# EasyEDA Pro project 主板&9V稳压.epro, board 主板V1
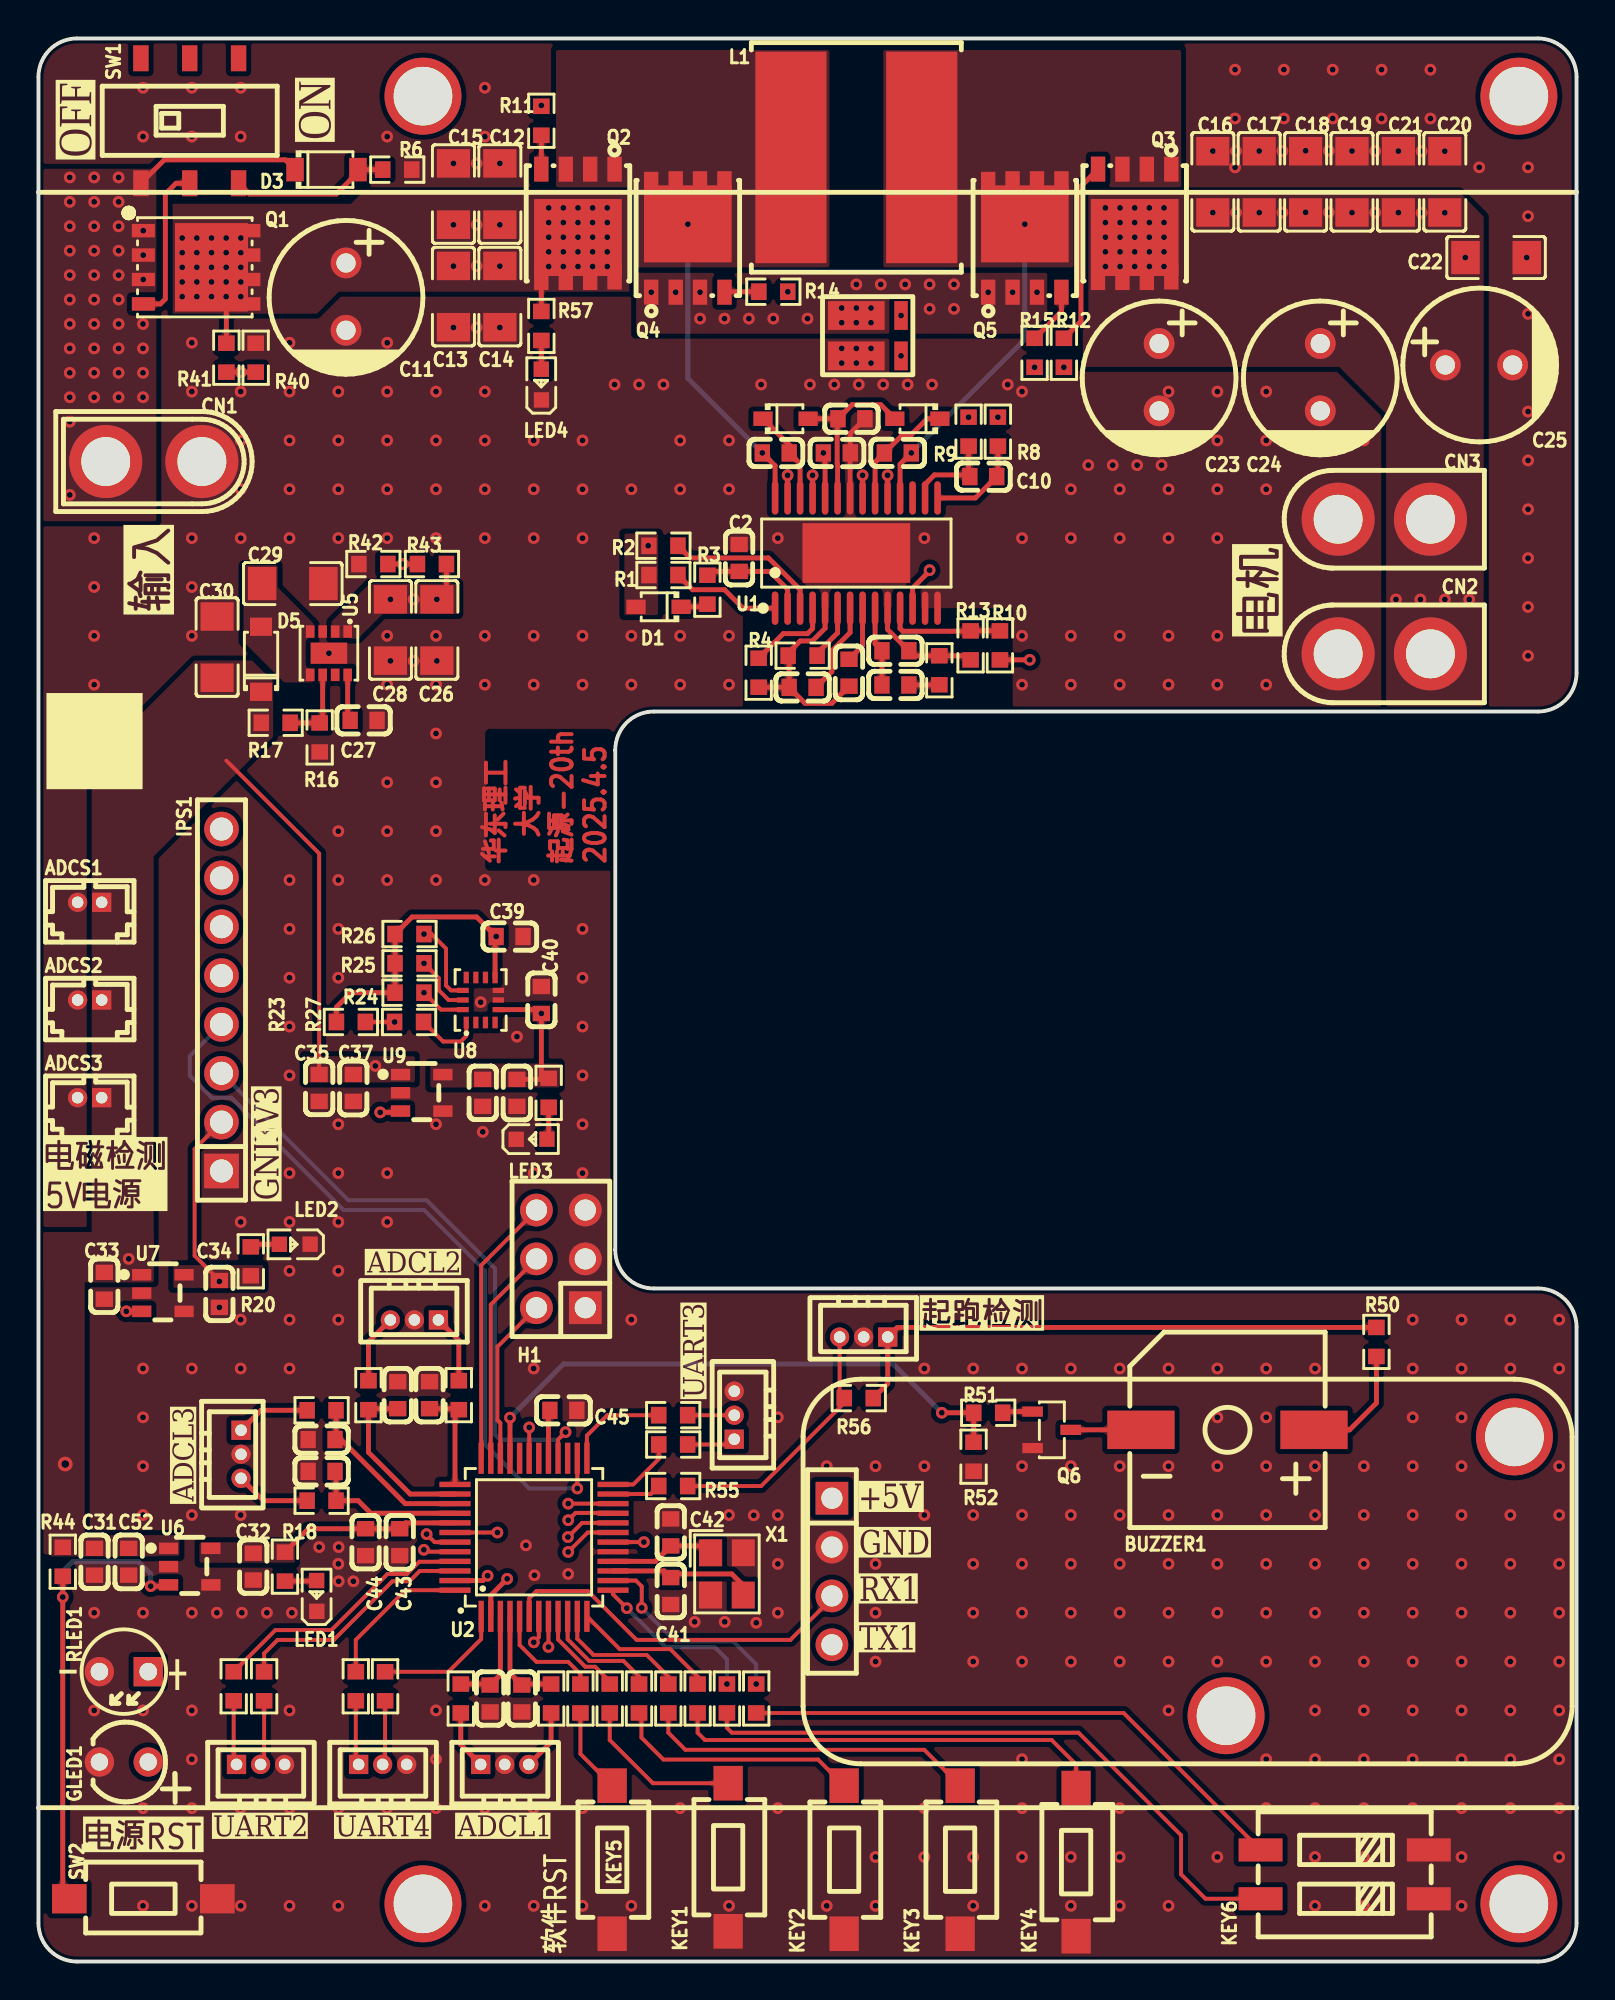
[diagram p4: board, top side]
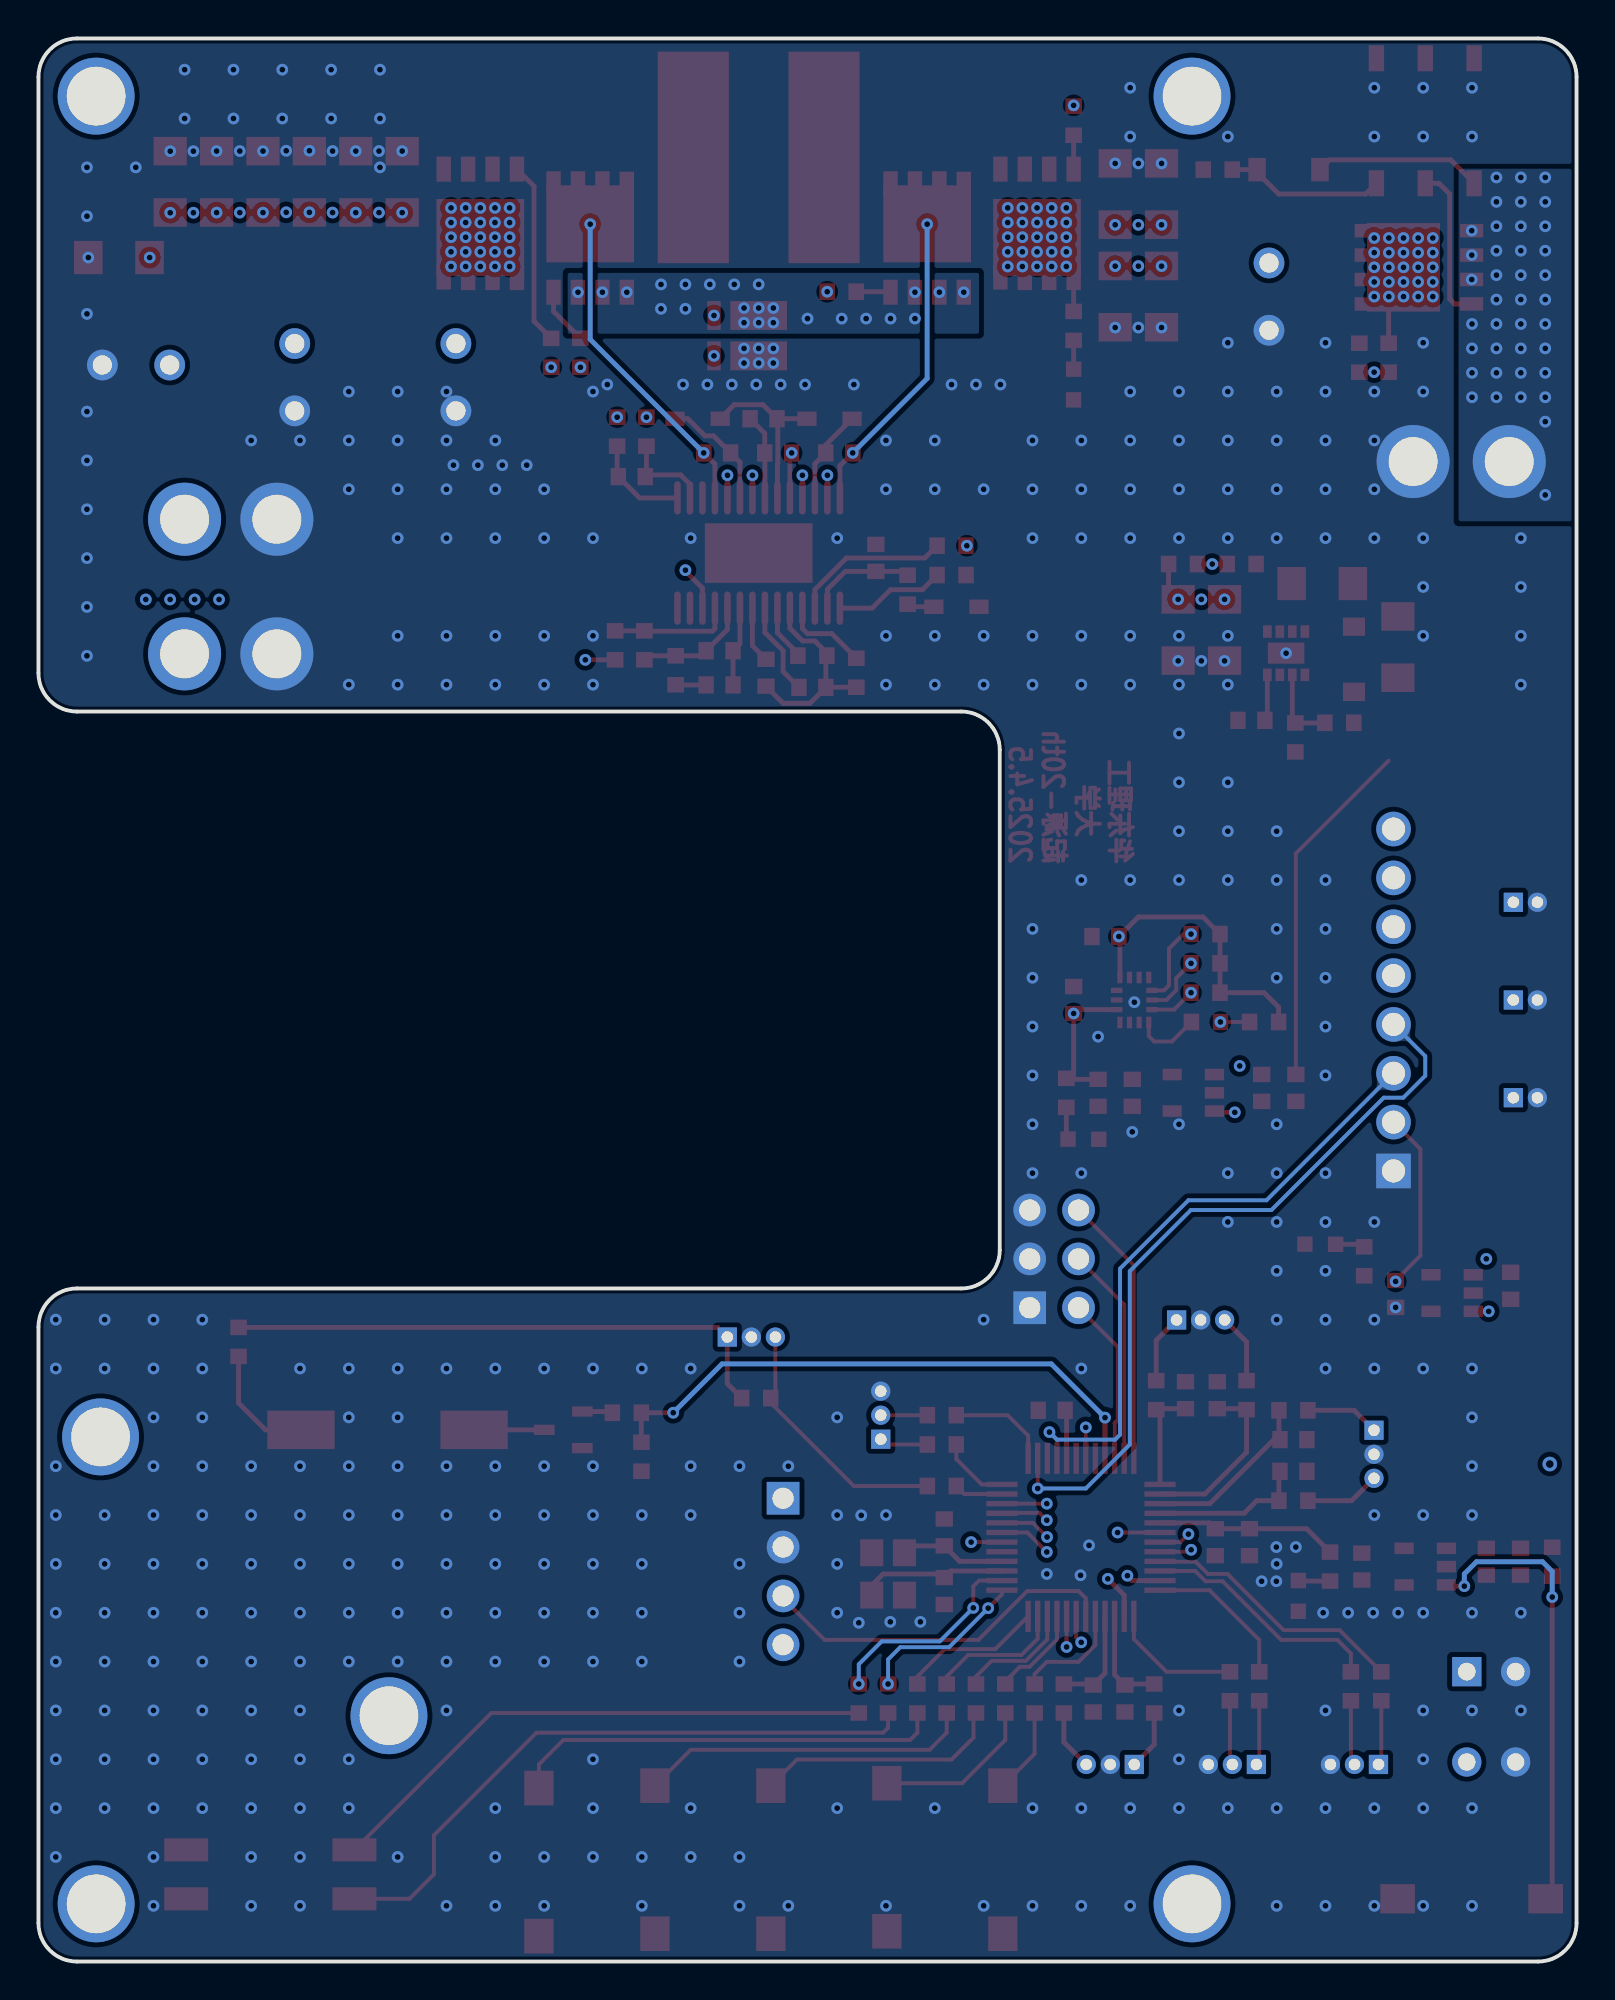
[diagram p5: board, bottom side, seen from below]

Outline 80 x 100 mm; copper layers: Top Layer, 主GND层, 辅助电源层, Bottom Layer. Coordinates in mm from the lower left corner of the outline.
Outline path: 0,98 0,2 arc(0.59,0.59) 2,0 78,0 arc(79.41,0.59) 80,2 80,33 arc(79.41,34.41) 78,35 32,35 arc(30.59,35.59) 30,37 30,63 arc(30.59,64.41) 32,65 78,65 arc(79.41,65.59) 80,67 80,98 arc(79.41,99.41) 78,100 2,100 arc(0.59,99.41) 0,98
Stack: Top Layer 0.035mm 外层铜厚1oz / Dielectric1 0.2104mm 7628 RC49% 8.6mil / 主GND层 0.0152mm 内层铜厚 / Dielectric2 1.065mm 1.1mm H/HOZ Copper / 辅助电源层 0.0152mm 内层铜厚 / Dielectric3 0.2104mm 7628 RC49% 8.6mil / Bottom Layer 0.035mm 外层铜厚1oz

## Design rules (mm)
template: xyf_v1.0
spacing copperThickness1oz (default): track to track 0.102, other pairs 0.152 to 0.3
spacing copperThickness2oz: track to track 0.203, other pairs 0.152 to 0.3
spacing copperThicknessInner0.5oz: track to track 0.089, other pairs 0.152 to 0.3
spacing 0焊盘板框间距: track to track 0.152, other pairs 0 to 0.3
track width copperThickness1oz (default): min 0.127, default 0.254, max 2.54
track width copperThickness2oz: min 0.203, default 0.254, max 2.54
track width copperThickness0.5oz: min 0.089, default 0.254, max 2.54
differential pair differentialPair (default): width min 0.127, default 0.254, max 2.54; gap min 0.152, default 0.152
via viaSize (default): diameter min 0.5, default 0.61, max 10; hole min 0.3, default 0.305, max 6.3
via viaSize2: diameter min 0.5, default 0.61, max 10; hole min 0.3, default 0.305, max 6.299
via viaSize4: diameter min 0.45, default 0.61, max 10; hole min 0.3, default 0.305, max 6.299

## Placement (name value [footprint] x y rotation side)
ADCL1  HC-1.25-3A  [CONN-TH_3P-P1.25_HCTL_HC-1.25-3A]  24.25 10.25 0 top
ADCL2  HC-1.25-3A  [CONN-TH_3P-P1.25_HCTL_HC-1.25-3A]  19.55 33.36 180 top
ADCL3  HC-1.25-3A  [CONN-TH_3P-P1.25_HCTL_HC-1.25-3A]  10.54 26.38 270 top
ADCS1  WAFER-MX1.25-2PZZ  [CONN-TH_2P-P1.25-V-M_721]  2.66 55.08 0 top
ADCS2  WAFER-MX1.25-2PZZ  [CONN-TH_2P-P1.25-V-M_721]  2.66 50 0 top
ADCS3  WAFER-MX1.25-2PZZ  [CONN-TH_2P-P1.25-V-M_721]  2.66 44.92 0 top
BUZZER1  3kHz  [BUZ-SMD_L9.6-W9.6-LS10.0-R]  61.84 27.65 0 top
C1  100nF  [C0603]  41.52 78.45 180 top
C2  100nF  [C0603]  36.44 72.99 90 top
C3  100nF  [C0603]  38.35 78.45 180 top
C4  1uF  [C0603]  42.29 80.23 0 top
C5  220pF  [C0603]  39.75 66.26 0 top
C6  15nF  [C0603]  42.16 67.02 90 top
C7  56nF  [C0603]  44.57 66.38 0 top
C8  1.5nF  [C0603]  44.57 68.16 180 top
C9  100nF  [C0603]  44.7 78.45 0 top
C10  47pF  [C0603]  49.14 77.22 180 top
C11  680uF  [CAP-TH_BD8.0-P3.50-D0.6-FD]  16 86.58 270 top
C12  10uF  [C1206]  24 91.91 270 top
C13  10uF  [C1206]  21.59 86.58 90 top
C14  10uF  [C1206]  24 86.58 90 top
C15  10uF  [C1206]  21.59 91.91 270 top
C16  10uF  [C1206]  61.08 92.55 270 top
C17  10uF  [C1206]  63.5 92.55 270 top
C18  10uF  [C1206]  65.91 92.55 270 top
C19  10uF  [C1206]  68.32 92.55 270 top
C20  10uF  [C1206]  73.15 92.55 270 top
C21  10uF  [C1206]  70.73 92.55 270 top
C22  10uF  [C1206]  75.81 88.61 180 top
C23  680uF  [CAP-TH_BD8.0-P3.50-D0.6-FD]  58.29 82.39 270 top
C24  680uF  [CAP-TH_BD8.0-P3.50-D0.6-FD]  66.67 82.39 270 top
C25  680uF  [CAP-TH_BD8.0-P3.50-D0.6-FD]  74.93 83.02 0 top
C26  22uF  [C1206]  20.72 69.24 90 top
C27  430pF  [C0603]  16.91 64.54 0 top
C28  22uF  [C1206]  18.31 69.24 90 top
C29  22uF  [C1206]  13.23 71.65 180 top
C30  22uF  [C1206]  9.29 68.35 270 top
C31  22uF  [C0603]  2.92 20.79 90 top
C32  22uF  [C0603]  11.17 20.54 90 top
C33  22uF  [C0603]  3.42 35.14 90 top
C34  22uF  [C0603]  9.41 34.72 90 top
C35  22uF  [C0603]  14.6 45.43 90 top
C36  22uF  [C0603]  23.11 45.17 90 top
C37  100nF  [C0603]  16.38 45.43 90 top
C38  100nF  [C0603]  24.89 45.17 90 top
C39  100nF  [C0603]  24.51 53.3 180 top
C40  100nF  [C0603]  26.16 50 270 top
C41  15pF  [C0603]  32.89 19.27 90 top
C42  15pF  [C0603]  32.89 22.31 90 top
C43  100nF  [C0603]  18.79 21.81 90 top
C44  22uF  [C0603]  17.01 21.81 90 top
C45  100nF  [C0603]  27.3 28.66 180 top
C46  22nF  [C0603]  23.49 13.68 90 top
C47  22nF  [C0603]  25.14 13.68 90 top
C48  22nF  [C0603]  20.34 29.45 270 top
C49  22nF  [C0603]  18.69 29.45 270 top
C50  22nF  [C0603]  14.73 27.14 0 top
C51  22nF  [C0603]  14.73 25.49 0 top
C52  100nF  [C0603]  4.69 20.79 90 top
CN1  XT30U-M  [CONN-TH_XT30U-M]  6 78 0 top
CN2  XT30U-F  [CONN-TH_XT30U-F]  70 68 180 top
CN3  XT30U-F  [CONN-TH_XT30U-F]  70 75 180 top
D1  1N5819WS  [SOD-323_L1.8-W1.3-LS2.5-RD]  32.25 70.45 180 top
D2  1N5819WS  [SOD-323_L1.8-W1.3-LS2.5-RD]  38.86 80.23 0 top
D3  MMSZ5252B  [SOD-123_L2.7-W1.6-LS3.7-RD]  14.98 93.18 0 top
D4  1N5819WS  [SOD-323_L1.8-W1.3-LS2.5-RD]  45.72 80.23 180 top
D5  B5819W  [SOD-123_L2.8-W1.8-LS3.7-RD]  11.58 67.72 90 top
GLED1  TJ-L3FYTLDKMCGSFLC7K-A5  [LED-TH_BD3.8-P2.54-FD]  4.44 10.38 180 top
H1  PZ254V-12-6P  [HDR-TH_6P-P2.54-V-M-R2-C3-S2.54]  27.17 36.54 90 top
IPS1  2.54-1*8P母环保  [HDR-TH_8P-P2.54-V-F-1]  9.52 50 90 top
KEY1  TS3625A  [KEY-SMD_L6.0-W3.5-LS8.4]  35.87 5.42 270 top
KEY2  TS3625A  [KEY-SMD_L6.0-W3.5-LS8.4]  41.91 5.3 270 top
KEY3  TS3625A  [KEY-SMD_L6.0-W3.5-LS8.4]  47.94 5.3 270 top
KEY4  TS3625A  [KEY-SMD_L6.0-W3.5-LS8.4]  53.97 5.17 270 top
KEY5  TS3625A  [KEY-SMD_L6.0-W3.5-LS8.4]  29.84 5.3 270 top
KEY6  DSPV02LSGET  [SW-SMD_DSPV02LSGET]  67.94 4.53 90 top
L1  2.2uH  [IND-SMD_L11.9-W11.0]  42.54 93.81 0 top
LED1  XL-1608SURC-06  [LED0603-RD_RED]  14.47 19.01 90 top
LED2  XL-1608SURC-06  [LED0603-RD_RED]  13.33 37.3 180 top
LED3  XL-1608SURC-06  [LED0603-RD_RED]  25.65 42.76 0 top
LED4  XL-1608SURC-06  [LED0603-RD_RED]  26.16 82 90 top
Q1  AGM30P100A  [PDFN-8_L5.8-W4.9-P1.27-LS6.1-BL-A]  8.25 88.1 270 top
Q2  BSC0702LS  [PG-TDSON-8_L5.0-W6.0-P1.27-BL-EP]  28.06 90.39 180 top
Q3  BSC0702LS  [PG-TDSON-8_L5.0-W6.0-P1.27-BL-EP]  57.02 90.39 180 top
Q4  BSC0702LS  [PG-TDSON-8_L5.0-W6.0-P1.27-BL-EP]  33.78 89.62 0 top
Q5  BSC0702LS  [PG-TDSON-8_L5.0-W6.0-P1.27-BL-EP]  51.3 89.62 0 top
Q6  S8050  [SOT-23-3_L2.9-W1.3-P1.90-LS2.3-BR]  52.7 27.65 180 top
QR1  -  [JLC-QRCODE-5x5]  2.92 63.46 0 top
R1  2kΩ  [R0603]  32.51 72.1 180 top
R2  2kΩ  [R0603]  32.51 73.62 180 top
R3  10Ω  [R0603]  34.79 71.34 270 top
R4  93.1kΩ  [R0603]  37.46 67.02 90 top
R5  20kΩ  [R0603]  39.75 67.91 0 top
R6  10kΩ  [R0603]  18.66 93.18 0 top
R7  5.23kΩ  [R0603]  46.86 67.14 270 top
R8  100Ω  [R0603]  49.9 79.55 270 top
R9  100Ω  [R0603]  48.38 79.55 270 top
R10  205kΩ  [R0603]  50.01 68.44 270 top
R11  1.5Ω  [R0603]  26.16 95.72 270 top
R12  1.5Ω  [R0603]  53.34 83.66 270 top
R13  20kΩ  [R0603]  48.48 68.44 90 top
R14  1.5Ω  [R0603]  38.22 86.83 180 top
R15  1.5Ω  [R0603]  51.81 83.66 270 top
R16  100kΩ  [R0603]  14.63 63.65 270 top
R17  523kΩ  [R0603]  12.34 64.42 0 top
R18  10kΩ  [R0603]  12.82 20.54 90 top
R20  10kΩ  [R0603]  11.04 36.41 270 top
R21  10kΩ  [R0603]  26.54 45.17 90 top
R23  10kΩ  [R0603]  16.25 48.86 180 top
R24  10kΩ  [R0603]  19.3 50.38 0 top
R25  10kΩ  [R0603]  19.3 51.91 0 top
R26  10kΩ  [R0603]  19.3 53.43 0 top
R27  100Ω  [R0603]  19.28 48.86 0 top
R28  100Ω  [R0603]  16.5 14.31 270 top
R29  100Ω  [R0603]  11.74 14.31 270 top
R30  100Ω  [R0603]  10.16 14.31 270 top
R31  100Ω  [R0603]  33.01 26.89 180 top
R32  100Ω  [R0603]  33.01 28.41 0 top
R33  100Ω  [R0603]  18.03 14.31 90 top
R34  100Ω  [R0603]  21.97 13.68 270 top
R35  100Ω  [R0603]  26.66 13.68 270 top
R36  100Ω  [R0603]  21.86 29.45 90 top
R37  100Ω  [R0603]  17.16 29.45 90 top
R38  100Ω  [R0603]  14.73 28.66 180 top
R39  100Ω  [R0603]  14.73 23.97 180 top
R40  10kΩ  [R0603]  11.3 83.4 270 top
R41  47kΩ  [R0603]  9.77 83.4 90 top
R42  10kΩ  [R0603]  17.42 72.67 0 top
R43  47kΩ  [R0603]  20.47 72.67 0 top
R44  10kΩ  [R0603]  1.27 20.79 270 top
R45  100Ω  [R0603]  28.19 13.68 270 top
R46  100Ω  [R0603]  29.71 13.68 270 top
R47  100Ω  [R0603]  31.24 13.68 270 top
R48  100Ω  [R0603]  32.76 13.68 270 top
R49  100Ω  [R0603]  34.28 13.68 270 top
R50  10Ω  [R0603]  69.59 32.22 90 top
R51  5.23kΩ  [R0603]  49.4 28.54 180 top
R52  1kΩ  [R0603]  48.64 26.25 270 top
R53  100Ω  [R0603]  35.81 13.68 270 top
R54  100Ω  [R0603]  37.33 13.68 270 top
R55  100Ω  [R0603]  33.01 24.73 0 top
R56  10kΩ  [R0603]  42.67 29.3 0 top
R57  10kΩ  [R0603]  26.16 85.05 270 top
RLED1  TJ-L3FYTGHRMFCLFLC2R-A5  [LED-TH_BD3.9-P2.54-FD]  4.44 15.07 180 top
Rs1  2mΩ  [RES-SMD_4P-L3.0-W3.8_HOBB1216]  43.7 84.54 270 top
RUNNING1  HC-1.25-3A  [CONN-TH_3P-P1.25_HCTL_HC-1.25-3A]  42.92 32.47 180 top
SCREW1  -  [M2螺丝]  20 97 0 top
SCREW2  -  [M2螺丝]  77 97 0 top
SCREW3  -  [M2螺丝]  20 3 0 top
SCREW4  -  [M2螺丝]  77 3 0 top
SCREW5  -  [M2螺丝]  61.77 12.78 0 top
SCREW6  -  [M2螺丝]  76.77 27.28 0 top
SW1  SS-3235S-L3  [SW-SMD_SS-3235S-L3.00]  7.87 95.72 180 top
SW2  TS3625A  [KEY-SMD_L6.0-W3.5-LS8.4]  5.46 3.26 0 top
U1  LM5176PWPR  [HTSSOP-28_L9.7-W4.4-P0.65-LS6.4-BL-EP]  42.54 73.24 0 top
U2  AI8051U-34K64-QFP48  [LQFP-48_L7.0-W7.0-P0.50-LS9.0-BL_1]  25.78 22.06 0 top
U5  TPS82130SILR  [USIP-8_L3.0-W2.8-P0.65-TL-EP]  15.11 68.03 270 top
U6  TPS7A2033PDBVR  [SOT-23-5_L2.9-W1.6-P0.95-LS2.8-BR]  7.87 20.54 180 top
U7  TPS7A2033PDBVR  [SOT-23-5_L2.9-W1.6-P0.95-LS2.8-BR]  6.47 34.76 180 top
U8  BMI270  [LGA-14_L3.0-W2.5-P0.50-BR]  23 50 270 top
U9  TPS7A2033PDBVR  [SOT-23-5_L2.9-W1.6-P0.95-LS2.8-BR]  19.93 45.17 180 top
UART1  PM254V-11-04-H85  [HDR-TH_4P-P2.54-V-F]  41.27 20.28 270 top
UART2  HC-1.25-3A  [CONN-TH_3P-P1.25_HCTL_HC-1.25-3A]  11.55 10.25 0 top
UART3  HC-1.25-3A  [CONN-TH_3P-P1.25_HCTL_HC-1.25-3A]  36.19 28.41 90 top
UART4  HC-1.25-3A  [CONN-TH_3P-P1.25_HCTL_HC-1.25-3A]  17.9 10.25 0 top
X1  40MHz  [CRYSTAL-SMD_4P-L3.2-W2.5-BL]  35.81 20.16 270 top

## Footprints (pads in the part's own frame, mm; a bottom-side part is the same pattern mirrored in y, then rotated)
BUZ-SMD_L9.6-W9.6-LS10.0-R
  rect 3.5x2 smd: 1(4.5,0) 2(-4.5,0)
C0603
  rect 0.8x0.9 smd: 1(-0.7,0) 2(0.7,0)
C1206
  rect 1.485x1.728 smd: 1(-1.593,0) 2(1.593,0)
CAP-TH_BD8.0-P3.50-D0.6-FD
  round 1.6 hole 1: 1(-1.75,0) 2(1.75,0)
CONN-TH_2P-P1.25-V-M_721
  rect 1x1 hole 0.6: 1(0.625,0)
  round 1 hole 0.6: 2(-0.625,0)
CONN-TH_3P-P1.25_HCTL_HC-1.25-3A
  rect 1x1 hole 0.6: 1(-1.25,0)
  round 1 hole 0.6: 2(0,0) 3(1.25,0)
CONN-TH_XT30U-F
  round 3.8 hole 2.54: 1(2.4,0) 2(-2.4,0)
CONN-TH_XT30U-M
  round 3.8 hole 2.54: 1(-2.5,0) 2(2.5,0)
CRYSTAL-SMD_4P-L3.2-W2.5-BL
  rect 1.4x1.2 smd: 1(-1.1,-0.85) 2(1.1,-0.85) 3(1.1,0.85) 4(-1.1,0.85)
HDR-TH_4P-P2.54-V-F
  rect 1.7x1.7 hole 1.1: 1(-3.81,0)
  round 1.7 hole 1.1: 2(-1.27,0) 3(1.27,0) 4(3.81,0)
HDR-TH_6P-P2.54-V-M-R2-C3-S2.54
  rect 1.7x1.7 hole 1.1: 1(-2.54,-1.27)
  round 1.7 hole 1.1: 2(-2.54,1.27) 3(0,-1.27) 4(0,1.27) 5(2.54,-1.27) 6(2.54,1.27)
HDR-TH_8P-P2.54-V-F-1
  rect 1.8x1.8 hole 1.2: 1(-8.89,0)
  round 1.8 hole 1.2: 2(-6.35,0) 3(-3.81,0) 4(-1.27,0) 5(1.27,0) 6(3.81,0) 7(6.35,0) 8(8.89,0)
HTSSOP-28_L9.7-W4.4-P0.65-LS6.4-BL-EP
  oval 0.343x1.732 smd: 1(-4.225,-2.866) 2(-3.575,-2.866) 3(-2.925,-2.866) 4(-2.275,-2.866) 5(-1.625,-2.866) 6(-0.975,-2.866) 7(-0.325,-2.866) 8(0.325,-2.866) 9(0.975,-2.866) 10(1.625,-2.866) 11(2.275,-2.866) 12(2.925,-2.866) 13(3.575,-2.866) 14(4.225,-2.866) 15(4.225,2.866) 16(3.575,2.866) 17(2.925,2.866) 18(2.275,2.866) 19(1.625,2.866) 20(0.975,2.866) 21(0.325,2.866) 22(-0.325,2.866) 23(-0.975,2.866) 24(-1.625,2.866) 25(-2.275,2.866) 26(-2.925,2.866) 27(-3.575,2.866) 28(-4.225,2.866)
  rect 5.6x3.1 smd: 29(0,0)
IND-SMD_L11.9-W11.0
  rect 3.7x11 smd: 1(-3.4,0) 2(3.4,0)
KEY-SMD_L6.0-W3.5-LS8.4
  rect 1.8x1.524 smd: 1(-3.85,0) 2(3.85,0)
LED0603-RD_RED
  rect 0.8x0.8 smd: 1(-0.799,-0.004) 2(0.799,0.004)
LED-TH_BD3.8-P2.54-FD
  round 1.524 hole 0.9: 1(-1.27,0) 2(1.27,0)
LED-TH_BD3.9-P2.54-FD
  rect 1.524x1.524 hole 0.914: 1(-1.27,0)
  round 1.524 hole 0.914: 2(1.27,0)
LGA-14_L3.0-W2.5-P0.50-BR
  rect 0.6x0.27 smd: 1(1.17,-0.75) 2(1.17,-0.25) 3(1.17,0.25) 4(1.17,0.75) 8(-1.17,0.75) 9(-1.17,0.25) 10(-1.17,-0.25) 11(-1.17,-0.75)
  rect 0.27x0.6 smd: 5(0.5,0.92) 6(0,0.92) 7(-0.5,0.92) 12(-0.5,-0.92) 13(0,-0.92) 14(0.5,-0.92)
LQFP-48_L7.0-W7.0-P0.50-LS9.0-BL_1
  rect 0.28x1.62 smd: 1(-2.75,-4.11) 2(-2.25,-4.11) 3(-1.75,-4.11) 4(-1.25,-4.11) 5(-0.75,-4.11) 6(-0.25,-4.11) 7(0.25,-4.11) 8(0.75,-4.11) 9(1.25,-4.11) 10(1.75,-4.11) 11(2.25,-4.11) 12(2.75,-4.11) 25(2.75,4.11) 26(2.25,4.11) 27(1.75,4.11) 28(1.25,4.11) 29(0.75,4.11) 30(0.25,4.11) 31(-0.25,4.11) 32(-0.75,4.11) 33(-1.25,4.11) 34(-1.75,4.11) 35(-2.25,4.11) 36(-2.75,4.11)
  rect 1.62x0.28 smd: 13(4.11,-2.75) 14(4.11,-2.25) 15(4.11,-1.75) 16(4.11,-1.25) 17(4.11,-0.75) 18(4.11,-0.25) 19(4.11,0.25) 20(4.11,0.75) 21(4.11,1.25) 22(4.11,1.75) 23(4.11,2.25) 24(4.11,2.75) 37(-4.11,2.75) 38(-4.11,2.25) 39(-4.11,1.75) 40(-4.11,1.25) 41(-4.11,0.75) 42(-4.11,0.25) 43(-4.11,-0.25) 44(-4.11,-0.75) 45(-4.11,-1.25) 46(-4.11,-1.75) 47(-4.11,-2.25) 48(-4.11,-2.75)
M2螺丝
  round 4 hole 3.05x2.02: 1(0,0)
PDFN-8_L5.8-W4.9-P1.27-LS6.1-BL-A
  rect 0.7x1.2 smd: 1(-1.905,-2.792) 2(-0.635,-2.792) 3(0.635,-2.792) 4(1.905,-2.792)
  rect 0.7x1 smd: 5(1.905,2.792) 6(0.635,2.792) 7(-0.635,2.792) 8(-1.905,2.792)
  rect 4.6x3.8 smd: 9(0,0.75)
PG-TDSON-8_L5.0-W6.0-P1.27-BL-EP
  rect 0.75x1.3 smd: 1(-1.905,-2.82) 2(-0.635,-2.82) 3(0.635,-2.82) 4(1.905,-2.82) 5(1.905,2.82) 6(0.635,2.82) 7(-0.635,2.82) 8(-1.905,2.794)
  rect 4.56x4 smd: 8(0,0.737)
R0603
  rect 0.806x0.864 smd: 1(-0.753,0) 2(0.753,0)
RES-SMD_4P-L3.0-W3.8_HOBB1216
  rect 1.5x2.95 smd: 1(-1.05,-1.163) 2(1.05,-1.163)
  rect 1.5x0.7 smd: 3(-1.05,1.163) 4(1.05,1.163)
SOD-123_L2.7-W1.6-LS3.7-RD
  rect 0.91x1.22 smd: 1(-1.635,0) 2(1.635,0)
SOD-123_L2.8-W1.8-LS3.7-RD
  rect 0.95x1.15 smd: 1(-1.692,0) 2(1.692,0)
SOD-323_L1.8-W1.3-LS2.5-RD
  rect 1x0.75 smd: 1(-1.173,0) 2(1.173,0)
SOT-23-3_L2.9-W1.3-P1.90-LS2.3-BR
  rect 1.07x0.532 smd: 1(0.99,-0.95) 2(0.99,0.95) 3(-0.99,0)
SOT-23-5_L2.9-W1.6-P0.95-LS2.8-BR
  rect 1x0.6 smd: 1(1.1,-0.95) 2(1.1,0) 3(1.1,0.95) 4(-1.1,0.95) 5(-1.1,-0.95)
SW-SMD_DSPV02LSGET
  rect 1.2x2.286 smd: 1(1.27,4.375) 2(-1.27,4.375) 3(-1.27,-4.375) 4(1.27,-4.375)
SW-SMD_SS-3235S-L3.00
  rect 0.8x1.35 smd: 1(-2.54,3.25) 2(0,3.25) 3(2.54,3.25) 4(-2.54,-3.25) 5(0,-3.25) 6(2.54,-3.25)
USIP-8_L3.0-W2.8-P0.65-TL-EP
  rect 0.65x0.45 smd: 1(-1.125,0.975) 2(-1.125,0.325) 3(-1.125,-0.325) 4(-1.125,-0.975) 5(1.125,-0.975) 6(1.125,-0.325) 7(1.125,0.325) 8(1.125,0.975)
  rect 1.1x1.9 smd: 9(0,0)

## Nets
As in the schematic.

Pads without a net: SCREW1 1; SCREW2 1; SCREW3 1; SCREW4 1; SCREW5 1; SCREW6 1; SW1 4 5 6; U1 17; U2 27 30 32; U5 7; U8 2 3 4 9 10 11

## Via types
v1: diameter 0.61, hole 0.305, Top Layer to Bottom Layer, 630 vias
v2: diameter 0.762, hole 0.406, Top Layer to Bottom Layer, 1 via

## Routing (per net, layer and track width the routed paths; a pad name or vN(x,y) marks a point on that pad's centre or on a via; arc(x,y) is an arc through that point)
3V3: length 113.8
  Top Layer w0.203: IPS1.2 8.12,42.25 8.12,36.7 C34.2
  Top Layer w0.254: R50.2 44.67,32.97 RUNNING1.1 44.17,30.05 R56.2
  辅助电源层 w0.203: RUNNING1.1 43.28,33.36 32,33.36 29.55,35.82 29.55,54.36 23.49,60.41 9.01,60.41 8.12,59.53 8.12,45.05 IPS1.2
  vias: v1(9.41,35.37)
+5V: length 106.9
  Top Layer w0.203: C35.2 14.6,57.62 9.77,62.45
  Top Layer w0.254: U7.3 v1(4.57,33.81) ; U9.3 18.77,44.16 v1(17.78,44.16)
  辅助电源层 w0.254: v1(4.57,33.81) 4.57,36.41 v1(4.69,36.54) ; v1(17.78,44.16) 17.52,44.41 v1(17.52,46.57)
  辅助电源层 w0.508: UART1.1 43.05,24.09 45.72,21.43 45.72,9.87 41.78,5.93 4.19,5.93 1.98,8.14 1.98,25.29 v2(1.39,25.87)
+9V: length 58.1
  Top Layer w0.254: v1(20.72,70.83) 21.22,71.33 R43.2 ; U1.24 40.91,78.36 v1(40.82,78.45) ; v1(46.35,72.35) 46.35,72.31 45.47,71.42 U1.12 ; R10.2 v1(51.56,67.69)
  主GND层 w0.254: v1(51.56,67.69) 66.67,82.8 C24.1
  辅助电源层 w0.254: 49.61,75.62 43.21,75.62 40.82,78 v1(40.82,78.45) ; 49.61,75.62 v1(46.35,72.35) ; 49.61,75.62 58.13,84.14 C23.1
  vias: v1(18.31,70.83) v1(19.51,70.83) v1(55.49,91.19) v1(55.49,90.43) v1(55.49,89.67) v1(55.49,88.9) v1(55.49,88.14) v1(56.26,91.19) v1(56.26,90.43) v1(56.26,89.67) v1(56.26,88.9) v1(56.26,88.14) v1(57.02,91.19) v1(57.02,90.43) v1(57.02,89.67) v1(57.02,88.9) v1(57.02,88.14) v1(57.78,91.19) v1(57.78,90.43) v1(57.78,89.67) v1(57.78,88.9) v1(57.78,88.14) v1(58.54,91.19) v1(58.54,90.43) v1(58.54,89.67) v1(58.54,88.9) v1(58.54,88.14) v1(61.08,90.94) v1(62.29,90.94) v1(63.5,90.94) v1(64.7,90.94) v1(65.91,90.96) v1(67.11,90.96) v1(68.32,90.94) v1(69.53,90.94) v1(70.61,70.83) v1(70.73,90.94) v1(71.94,90.94) v1(71.88,70.83) v1(73.15,90.94) v1(73.15,70.83) v1(74.21,88.61) v1(74.42,70.83)
GND: length 21.2
  Top Layer w0.254: 39.05,66.25 39.87,65.43 41.27,65.43 C6.1 ; C4.2 42.22,79.46 C1.1 42.22,78.44 U1.22 ; R13.1 48.27,67.9 R7.1 45.53,67.9 C8.1 44.16,69.27 U1.10 ; U1.5 40.91,69.33 40.25,68.67 39.62,68.67 38.99,68.04 R5.1 39.05,67.85 C5.1 39.04,66.26 R4.1
  vias: v1(2.9,74.02) v1(2.9,71.48) v1(2.9,68.94) v1(2.9,66.4) v1(2.9,18.14) v1(2.9,13.06) v1(5.44,97.44) v1(5.44,94.9) v1(5.44,30.84) v1(5.44,28.3) v1(5.44,25.76) v1(5.44,23.22) v1(5.44,18.14) v1(5.44,13.06) v1(5.44,7.98) v1(5.44,2.9) v1(7.98,97.44) v1(7.98,94.9) v1(7.98,84.18) v1(7.98,81.64) v1(7.98,74.02) v1(7.98,71.48) v1(7.98,68.94) v1(7.98,30.84) v1(7.98,23.22) v1(7.98,18.14) v1(7.98,13.06) v1(7.98,10.52) v1(7.98,7.98) v1(7.98,2.9) v1(9.28,18.14) v1(9.41,34.02) v1(10.52,97.44) v1(10.52,94.9) v1(10.52,81.64) v1(10.52,79.1) v1(10.52,76.56) v1(10.52,74.02) v1(10.52,38.46) v1(10.52,33.38) v1(10.52,30.84) v1(10.52,23.22) v1(10.52,7.98) v1(10.52,2.9) v1(10.58,18.14) v1(11.88,18.14) v1(13.06,84.18) v1(13.06,81.64) v1(13.06,79.1) v1(13.06,76.56) v1(13.06,74.02) v1(13.06,56.24) v1(13.06,53.7) v1(13.06,51.16) v1(13.06,48.62) v1(13.06,46.08) v1(13.06,41) v1(13.06,38.46) v1(13.06,35.92) v1(13.06,33.38) v1(13.06,30.84) v1(13.06,13.06) v1(13.06,7.98) v1(13.06,2.9) v1(13.18,18.14) v1(14.6,21.55) v1(15.11,68.03) v1(15.6,81.64) v1(15.6,79.1) v1(15.6,76.56) v1(15.6,74.02) v1(15.6,58.78) v1(15.6,56.24) v1(15.6,53.7) v1(15.6,51.16) v1(15.6,43.54) v1(15.6,41) v1(15.6,38.46) v1(15.6,35.92) v1(15.6,33.38) v1(15.62,21.55) v1(15.6,20.68) v1(15.62,19.77) v1(15.6,7.98) v1(15.6,2.9) v1(16.38,19.77) v1(18.14,94.9) v1(18.14,84.18) v1(18.14,81.64) v1(18.14,79.1) v1(18.14,76.56) v1(18.14,74.02) v1(18.14,68.94) v1(18.14,66.4) v1(18.14,61.32) v1(18.14,58.78) v1(18.14,56.24) v1(18.14,41) v1(18.14,38.46) v1(18.14,7.98) v1(18.31,67.63) v1(19.51,67.63) v1(20.68,81.64) v1(20.68,79.1) v1(20.68,76.56) v1(20.68,74.02) v1(20.68,68.94) v1(20.72,67.63) v1(20.68,66.4) v1(20.68,63.86) v1(20.68,61.32) v1(20.68,58.78) v1(20.68,56.24) v1(20.68,43.54) v1(20.68,13.06) v1(20.68,10.52) v1(20.68,7.98) v1(21.59,93.5) v1(21.59,84.97) v1(22.79,93.5) v1(22.79,84.97) v1(23,49.89) v1(23.11,43.14) v1(23.22,97.44) v1(23.22,94.9) v1(23.22,81.64) v1(23.22,79.1) v1(23.22,76.56) v1(23.22,74.02) v1(23.22,68.94) v1(23.22,66.4) v1(23.22,56.24) v1(23.22,7.98) v1(23.22,2.9) v1(24,93.5) v1(24,84.97) v1(24.89,48.09) v1(25.36,21.64) v1(25.76,79.1) v1(25.76,76.56) v1(25.76,74.02) v1(25.76,68.94) v1(25.76,66.4) v1(25.76,56.24) v1(25.76,41) v1(25.76,30.84) v1(25.8,20.09) v1(25.76,7.98) v1(25.76,2.9) v1(27.55,20.16) v1(28.3,79.1) v1(28.3,76.56) v1(28.3,74.02) v1(28.3,68.94) v1(28.3,66.4) v1(28.3,53.7) v1(28.3,51.16) v1(28.3,48.62) v1(28.3,46.08) v1(28.3,43.54) v1(28.3,41) v1(28.3,7.98) v1(28.3,2.9) v1(29.97,82) v1(30.84,76.56) v1(30.84,68.94) v1(30.84,66.4) v1(30.84,33.38) v1(30.84,2.9) v1(31.24,82) v1(32.51,82) v1(33.38,79.1) v1(33.38,76.56) v1(33.38,68.94) v1(33.38,66.4) v1(33.38,7.98) v1(34.13,17.66) v1(35.69,17.66) v1(35.92,79.1) v1(35.92,76.56) v1(35.92,68.94) v1(35.92,66.4) v1(35.92,23.22) v1(35.92,2.9) v1(37.21,23.2) v1(37.33,17.62) v1(37.59,82) v1(38.46,74.02) v1(38.46,28.3) v1(38.46,23.22) v1(38.46,20.68) v1(38.46,18.14) v1(38.46,7.98) v1(40.13,82) v1(41,25.76) v1(41,2.9) v1(41.4,82) v1(41.78,83.88) v1(41.78,83.12) v1(42.54,83.88) v1(42.54,83.12) v1(42.67,82) v1(43.3,83.88) v1(43.3,83.12) v1(43.54,25.76) v1(43.54,20.68) v1(43.54,18.14) v1(43.54,15.6) v1(43.54,5.44) v1(43.54,2.9) v1(43.94,82) v1(45.21,82) v1(46.08,74.02) v1(46.08,30.84) v1(46.08,25.76) v1(46.08,23.22) v1(46.08,7.98) v1(46.08,5.44) v1(46.48,82) v1(48.62,30.84) v1(48.62,23.22) v1(48.62,20.68) v1(48.62,18.14) v1(48.62,15.6) v1(48.62,5.44) v1(48.62,2.9) v1(50.41,82) v1(51.16,81.64) v1(51.16,74.02) v1(51.16,68.94) v1(51.16,66.4) v1(51.16,30.84) v1(51.16,25.76) v1(51.16,23.22) v1(51.16,20.68) v1(51.16,18.14) v1(51.16,15.6) v1(51.16,10.52) v1(51.16,7.98) v1(51.16,5.44) v1(53.7,76.56) v1(53.7,74.02) v1(53.7,68.94) v1(53.7,66.4) v1(53.7,30.84) v1(53.7,25.76) v1(53.7,23.22) v1(53.7,20.68) v1(53.7,18.14) v1(53.7,15.6) v1(53.7,5.44) v1(53.7,2.9) v1(54.6,77.81) v1(55.88,77.81) v1(56.24,79.1) v1(56.24,76.56) v1(56.24,74.02) v1(56.24,68.94) v1(56.24,66.4) v1(56.24,30.84) v1(56.24,25.76) v1(56.24,23.22) v1(56.24,20.68) v1(56.24,18.14) v1(56.24,15.6) v1(56.24,7.98) v1(56.24,5.44) v1(56.24,2.9) v1(57.15,77.81) v1(58.41,77.81) v1(58.78,81.64) v1(58.78,79.1) v1(58.78,76.56) v1(58.78,74.02) v1(58.78,68.94) v1(58.78,66.4) v1(58.78,30.84) v1(58.78,25.76) v1(58.78,23.22) v1(58.78,20.68) v1(58.78,18.14) v1(58.78,15.6) v1(58.78,13.06) v1(58.78,2.9) v1(61.08,94.14) v1(61.32,81.64) v1(61.32,79.1) v1(61.32,76.56) v1(61.32,74.02) v1(61.32,68.94) v1(61.32,66.4) v1(61.32,30.84) v1(61.32,28.3) v1(61.32,25.76) v1(61.32,23.22) v1(61.32,20.68) v1(61.32,18.14) v1(61.32,15.6) v1(61.32,5.44) v1(62.24,98.38) v1(62.24,95.84) v1(62.24,93.3) v1(62.29,94.14) v1(63.5,94.14) v1(63.86,81.64) v1(63.86,79.1) v1(63.86,76.56) v1(63.86,66.4) v1(63.86,30.84) v1(63.86,28.3) v1(63.86,25.76) v1(63.86,23.22) v1(63.86,20.68) v1(63.86,18.14) v1(63.86,15.6) v1(63.86,10.52) v1(63.86,7.98) v1(64.7,94.14) v1(64.78,98.38) v1(64.78,95.84) v1(65.91,94.16) v1(66.4,79.1) v1(66.4,30.84) v1(66.4,25.76) v1(66.4,23.22) v1(66.4,20.68) v1(66.4,18.14) v1(66.4,15.6) v1(66.4,13.06) v1(66.4,10.52) v1(66.4,7.98) v1(66.4,5.44) v1(66.4,2.9) v1(67.11,94.16) v1(67.32,98.38) v1(67.32,95.84) v1(68.32,94.14) v1(68.94,79.1) v1(68.94,25.76) v1(68.94,23.22) v1(68.94,20.68) v1(68.94,18.14) v1(68.94,15.6) v1(68.94,13.06) v1(68.94,10.52) v1(68.94,7.98) v1(68.94,5.44) v1(68.94,2.9) v1(69.53,94.14) v1(69.86,98.38) v1(69.86,95.84) v1(70.73,94.14) v1(71.48,33.38) v1(71.48,30.84) v1(71.48,28.3) v1(71.48,25.76) v1(71.48,23.22) v1(71.48,20.68) v1(71.48,18.14) v1(71.48,15.6) v1(71.48,13.06) v1(71.48,10.52) v1(71.48,7.98) v1(71.94,94.14) v1(72.4,98.38) v1(72.4,95.84) v1(73.15,94.14) v1(74.02,33.38) v1(74.02,30.84) v1(74.02,28.3) v1(74.02,25.76) v1(74.02,23.22) v1(74.02,20.68) v1(74.02,18.14) v1(74.02,15.6) v1(74.02,13.06) v1(74.02,10.52) v1(74.02,7.98) v1(74.02,5.44) v1(74.02,2.9) v1(74.94,93.3) v1(76.56,33.38) v1(76.56,30.84) v1(76.56,23.22) v1(76.56,20.68) v1(76.56,18.14) v1(76.56,15.6) v1(76.56,13.06) v1(76.56,10.52) v1(76.56,7.98) v1(77.41,88.61) v1(77.48,93.3) v1(77.48,90.76) v1(77.48,85.68) v1(77.48,80.6) v1(77.48,78.06) v1(77.48,75.52) v1(77.48,72.98) v1(77.48,70.44) v1(77.48,67.9) v1(79.1,33.38) v1(79.1,30.84) v1(79.1,25.76) v1(79.1,23.22) v1(79.1,20.68) v1(79.1,18.14) v1(79.1,15.6) v1(79.1,13.06) v1(79.1,10.52) v1(79.1,7.98) v1(79.1,5.44)
VCC: length 9.3
  Top Layer w0.254: C4.1 42.31,80.95 43.81,80.95 D4.2 ; C4.1 41.54,80.19 41.54,77.88 41.56,77.86 U1.23 ; C4.1 D2.2
VIN: length 23.6
  Top Layer w0.254: R41.2 9.77,87.33 v1(9,88.1) ; R57.1 Q2.5
  辅助电源层 w0.254: v1(31.71,73.62) 31.71,77.72 28.06,81.37 v1(28.06,88.14) v1(28.06,88.9) v1(28.06,89.67)
  vias: v1(7.48,89.62) v1(7.48,88.86) v1(7.48,88.1) v1(7.48,87.34) v1(7.48,86.58) v1(8.24,89.62) v1(8.24,88.86) v1(8.24,88.1) v1(8.24,87.34) v1(8.24,86.58) v1(9,89.62) v1(9,88.86) v1(9,87.34) v1(9,86.58) v1(9.76,89.62) v1(9.76,88.86) v1(9.76,88.1) v1(9.76,87.34) v1(9.76,86.58) v1(10.52,89.62) v1(10.52,88.86) v1(10.52,88.1) v1(10.52,87.34) v1(10.52,86.58) v1(21.59,90.31) v1(21.59,88.16) v1(22.79,90.31) v1(22.79,88.16) v1(24,90.31) v1(24,88.16) v1(26.54,91.19) v1(26.54,90.43) v1(26.54,89.67) v1(26.54,88.9) v1(26.54,88.14) v1(27.3,91.19) v1(27.3,90.43) v1(27.3,89.67) v1(27.3,88.9) v1(27.3,88.14) v1(28.06,91.19) v1(28.06,90.43) v1(28.82,91.19) v1(28.82,90.43) v1(28.82,89.67) v1(28.82,88.9) v1(28.82,88.14) v1(29.59,91.19) v1(29.59,90.43) v1(29.59,89.67) v1(29.59,88.9) v1(29.59,88.14)
ADC_9V: length 75.6
  Top Layer w0.254: R43.1 v1(18.95,72.67) R42.2 ; U2.2 23.53,19.05 v1(24.38,19.9)
  辅助电源层 w0.254: v1(18.95,72.67) 17.58,72.67 16.89,71.97 16.89,61.81 16.38,61.3 8.38,61.3 7.11,60.03 7.11,40.86 16.38,31.59 16.38,27.65 19.93,24.09 22.47,24.09 23.11,23.46 23.11,21.93 24.38,20.66 v1(24.38,19.9)
ADC_L1: length 5.4
  Top Layer w0.254: R35.1 25.19,14.43 C47.2 24.53,14.99 U2.4
ADC_L2: length 5.3
  Top Layer w0.254: U2.3 24.03,14.91 C46.2 23.44,14.43 R34.1
ADC_M1: length 8
  Top Layer w0.254: U2.40 17.29,23.31 16.63,23.97 R39.1 15.48,25.44 C51.2
ADC_M2: length 9.2
  Top Layer w0.254: R38.1 15.48,27.19 C50.2 15.74,27.14 19.07,23.81 U2.39
ADC_R1: length 9.2
  Top Layer w0.254: U2.38 19.34,24.31 17.16,26.48 R37.1 17.22,28.75 C49.2
ADC_R2: length 5.5
  Top Layer w0.254: C48.2 21.81,28.75 R36.1 21.67,28.5 U2.37
ADC_VIN: length 77.7
  Top Layer w0.254: R41.1 v1(10.53,82.65) R40.2 ; U2.47 23.11,19.81 v1(23.36,20.06)
  辅助电源层 w0.254: v1(10.53,82.65) 8.13,82.65 5.96,80.48 5.96,41.36 16,31.33 16,27.27 19.68,23.58 21.84,23.58 22.6,22.82 22.6,21.55 23.36,20.79 v1(23.36,20.06)
BEEP: length 30
  Top Layer w0.254: v1(46.99,28.54) R51.2 48.64,27.01 R52.1 ; U2.33 v1(24.53,28.28)
  Bottom Layer w0.254: v1(46.99,28.54) 44.44,31.08 27.32,31.08 v1(24.53,28.28)
CSG: length 6.4
  主GND层 w0.254: v1(49.9,80.31) 46.71,83.49 v1(44.87,83.49)
DIP1: length 8.8
  Top Layer w0.203: U2.13 29.89,19.09 v1(30.6,18.38)
  Bottom Layer w0.203: v1(35.81,14.43) 35.81,15.71 35.17,16.34 32.63,16.34 v1(30.6,18.38)
DIP2: length 10.9
  Top Layer w0.203: v1(31.38,18.39) 31.38,19.51 31.07,19.81 U2.14
  Bottom Layer w0.203: v1(37.33,14.43) 37.33,15.46 36.14,16.65 33.12,16.65 v1(31.38,18.39)
FB: length 6.3
  Top Layer w0.254: U1.11 44.81,69.31 44.95,69.18 48.47,69.18 R13.2 R10.1
HDRV1: length 27.9
  Top Layer w0.254: U1.27 v1(38.97,77.29)
  辅助电源层 w0.254: v1(38.97,77.29) 38.97,78.47 31.11,86.32 31.11,94.96 29.29,96.77 26.41,96.77 v1(26.16,96.52)
HDRV2: length 14.5
  Top Layer w0.254: U1.19 v1(44.16,77.29)
  辅助电源层 w0.254: v1(53.34,82.9) 53.34,80.99 51.56,79.21 44.95,79.21 44.16,78.42 v1(44.16,77.29)
IMU_3V3: length 27.4
  Top Layer w0.254: U8.5 25.96,49.5 v1(26.16,49.3) 26.16,45.87 C38.2 ; U8.8 23.75,53.25 v1(23.81,53.3) 22.79,54.32 19.43,54.32 R26.1 R25.1 R24.1 16.25,50.38 15.5,49.63 R23.2
  主GND层 w0.254: v1(23.81,53.3) 26.16,50.95 v1(26.16,49.3)
IMU_CS: length 42.6
  Top Layer w0.203: U2.18 v1(31.49,21.81) ; v1(20.05,53.43) 20.44,53.43 21.2,52.67 21.2,50.76 21.46,50.5 U8.12
  辅助电源层 w0.203: v1(31.49,21.81) 31.49,28.89 27.34,33.04 27.34,46.53 20.44,53.43 v1(20.05,53.43)
IMU_SDI: length 28.9
  Top Layer w0.203: U8.14 20.93,49.5 v1(20.05,50.38) ; U2.31 v1(25.53,27.78)
  辅助电源层 w0.203: v1(25.53,27.78) 25.53,29.17 24.18,30.52 24.18,46.26 v1(20.05,50.38)
IMU_SDO: length 32.5
  Top Layer w0.203: U2.42 v1(23.87,22.31) ; R23.1 v1(18.52,48.86)
  辅助电源层 w0.203: v1(23.87,22.31) 23.87,43.51 v1(18.52,48.86)
IMU_SPC: length 46.7
  Top Layer w0.203: v1(25.76,16.6) 26.03,16.86 U2.7 ; v1(20.05,51.91) 20.82,51.13 20.82,50.51 21.33,50 U8.13
  辅助电源层 w0.203: v1(25.76,16.6) 25.76,16.97 31.11,22.31 31.11,28.84 27.03,32.92 27.03,44.92 v1(20.05,51.91)
IPS_BLK: length 48.5
  Top Layer w0.203: U2.22 v1(27.55,23.81)
  主GND层 w0.203: IPS1.8 12.47,55.94 12.47,44.89 14.75,42.61 20.85,42.61 23.79,39.66 23.79,27.57 v1(27.55,23.81)
IPS_CS: length 46.9
  Top Layer w0.203: v1(27.55,22.95) 27.94,23.33 29.87,23.33 U2.21
  主GND层 w0.203: IPS1.7 12.16,53.71 12.16,44.77 14.62,42.3 20.72,42.3 23.49,39.54 23.49,27.01 v1(27.55,22.95)
IPS_DC: length 45.4
  Top Layer w0.203: U2.20 28.28,22.81 v1(27.54,22.07)
  主GND层 w0.203: IPS1.6 11.86,51.47 11.86,44.64 14.5,42 20.59,42 23.18,39.41 23.18,26.43 v1(27.54,22.07)
IPS_RST: length 43.9
  Top Layer w0.203: U2.19 28.57,22.31 v1(27.55,21.3)
  主GND层 w0.203: v1(27.55,21.3) 27.3,21.3 22.88,25.72 22.88,39.28 20.47,41.69 14.37,41.69 11.55,44.51 11.55,49.24 IPS1.5
IPS_SCL: length 32.5
  Top Layer w0.203: U2.28 27.03,27.14 v1(27.42,27.53)
  Bottom Layer w0.203: IPS1.3 16.12,39.59 20.19,39.59 23.74,36.03 23.74,27.39 24,27.14 27.03,27.14 v1(27.42,27.53)
IPS_SDA: length 39.3
  Top Layer w0.203: U2.26 v1(28.03,24.6)
  Bottom Layer w0.203: v1(28.03,24.6) 25.52,24.6 23.24,26.89 23.24,35.9 20.06,39.08 15.87,39.08 10.03,44.92 9.01,44.92 7.87,46.06 7.87,47.08 IPS1.4
K_NRST: length 5.8
  Top Layer w0.203: U2.5 25.03,16.46 25.9,15.58 27.55,15.58 28.19,14.95 R45.1
KEY1: length 4.9
  Top Layer w0.203: U2.9 27.03,16.75 28.44,15.33 28.95,15.33 29.71,14.57 R46.1
KEY2: length 6.1
  Top Layer w0.203: R47.1 31.24,14.82 30.42,15.63 28.65,15.63 27.53,16.75 U2.10
KEY3: length 7.1
  Top Layer w0.203: R48.1 32.76,14.82 31.64,15.94 28.87,15.94 28.03,16.79 U2.11
KEY4: length 7.4
  Top Layer w0.203: U2.12 30.23,16.24 32.86,16.24 34.28,14.82 R49.1
LDRV1: length 11.3
  Top Layer w0.254: U1.25 v1(40.26,77.29)
  辅助电源层 w0.254: v1(38.98,86.83) 38.98,79.22 40.26,77.93 v1(40.26,77.29)
LDRV2: length 14.5
  Top Layer w0.254: U1.21 v1(42.87,77.29)
  辅助电源层 w0.254: v1(51.81,82.9) 51.81,80.48 51.05,79.72 44.19,79.72 42.87,78.39 v1(42.87,77.29)
LED_G: length 24.1
  Top Layer w0.203: U2.43 20.6,21.81 v1(20.19,22.23)
  辅助电源层 w0.203: v1(20.19,22.23) 20.95,21.46 20.95,18.88 13.71,11.65 6.98,11.65 GLED1.1
LED_R: length 20.2
  Top Layer w0.203: U2.44 20.15,21.31 v1(20.05,21.41)
  辅助电源层 w0.203: RLED1.1 16.38,15.07 20.05,18.74 v1(20.05,21.41)
P0.4: length 14.1
  Top Layer w0.203: U2.36 23.03,36.2 H1.6
P0.5: length 11.4
  Top Layer w0.203: U2.35 23.53,34.16 H1.4
P0.6: length 8.7
  Top Layer w0.203: H1.2 23.87,31.97 23.87,28.16 23.97,28.06 23.97,28.05 24.03,27.99 U2.34
RCS: length 8.5
  主GND层 w0.254: v1(44.87,85.59) 44.28,85.01 44.28,83.25 44.62,82.91 46.79,82.91 48.38,81.33 v1(48.38,80.31)
RUNNING: length 2.5
  Top Layer w0.203: R55.1 31.84,24.31 U2.23
RX1: length 18.9
  Top Layer w0.203: UART1.3 41.27,18.88 39.11,16.73 31.11,16.73 28.57,19.27 25.9,19.27 25.53,18.89 U2.6
RX2: length 3.4
  Top Layer w0.203: UART2.1 10.16,10.4 R30.2
RX3: length 2.5
  Top Layer w0.203: UART3.1 35.92,26.89 R31.1
RX4: length 3.4
  Top Layer w0.203: R28.2 16.5,10.4 UART4.1
STC_3V3: length 9.5
  Top Layer w0.254: U2.41 19.09,22.81 C43.2 C44.2 14.04,22.51 R18.2
SW1: length 16.1
  Top Layer w0.254: v1(37.65,78.45) 38.31,77.78 U1.28
  Bottom Layer w0.254: v1(37.65,78.45) 33.78,82.32 v1(33.78,90.34)
SW2: length 16.9
  Top Layer w0.254: U1.18 44.81,77.86 v1(45.4,78.45)
  Bottom Layer w0.254: v1(51.3,90.34) 51.3,84.35 v1(45.4,78.45)
TX1: length 16.9
  Top Layer w0.203: U2.8 v1(26.53,16.36)
  辅助电源层 w0.203: UART1.4 41.27,16.11 41.13,15.96 26.92,15.96 v1(26.53,16.36)
TX2: length 3.4
  Top Layer w0.203: R29.2 11.74,10.43 UART2.2
TX3: length 2.4
  Top Layer w0.203: R32.2 UART3.2
TX4: length 3.4
  Top Layer w0.203: UART4.2 18.03,10.38 R33.1
VCAP: length 8.7
  Top Layer w0.254: SW1.3 6.55,93.69 12.84,93.69 D3.1
  vias: v1(1.63,92.77) v1(1.63,91.5) v1(1.63,90.23) v1(1.63,88.96) v1(1.63,87.69) v1(1.63,86.42) v1(1.63,85.15) v1(1.63,83.88) v1(1.63,82.61) v1(1.63,81.34) v1(1.63,80.07) v1(1.63,76.26) v1(2.9,92.77) v1(2.9,91.5) v1(2.9,90.23) v1(2.9,88.96) v1(2.9,87.69) v1(2.9,86.42) v1(2.9,85.15) v1(2.9,83.88) v1(2.9,82.61) v1(2.9,81.34) v1(4.17,92.77) v1(4.17,91.5) v1(4.17,90.23) v1(4.17,88.96) v1(4.17,87.69) v1(4.17,86.42) v1(4.17,85.15) v1(4.17,83.88) v1(4.17,82.61) v1(4.17,81.34) v1(5.44,85.15) v1(5.44,83.88) v1(5.44,82.61) v1(5.44,81.34) v1(5.45,90) v1(5.45,88.73) v1(5.45,87.47)
$1N903: length 5.6
  Top Layer w0.254: U1.2 38.97,71.36 38.03,72.29 34.99,72.29 R3.1
$1N1101: length 8.3
  Top Layer w0.254: R2.1 33.9,72.99 37.97,72.99 39.62,71.34 39.62,70.38
$1N1220: length 4.5
  Top Layer w0.254: R4.2 38.74,69.05 40,69.05 40.26,69.31 U1.4
$1N1330: length 2.9
  Top Layer w0.254: R5.2 40.5,68.03 41.56,69.09 U1.6
$1N1402: length 4.9
  Top Layer w0.254: U1.7 42.22,69.11 41.27,68.16 41.27,67.08 C5.2
$1N1711: length 2.9
  Top Layer w0.254: U1.8 42.87,68.42 C6.2
$1N1716: length 4.1
  Top Layer w0.254: C7.1 C8.2 43.51,68.52 U1.9
$1N2046: length 5.1
  Top Layer w0.254: R8.2 49.9,77.28 C10.1 48.73,76.11 U1.15
$1N2059: length 4.8
  Top Layer w0.254: R9.2 48.38,77.28 ; 48.38,77.28 C10.2 ; 48.38,77.28 48.35,77.31 46.6,77.31 46.12,76.82 46.12,76.11
$1N2215: length 4.9
  Top Layer w0.254: 39.62,76.11 39.62,77.88 C3.1 39.05,78.86 D2.1
$1N23253: length 1.4
  Top Layer w0.254: R3.2 34.66,70.45 D1.1
$1N28303: length 5.8
  Top Layer w0.254: U1.1 36.64,70.38 35.68,71.34 34.02,71.34 R1.1
$1N30337:
  vias: v1(31.87,86.8) v1(33.14,86.8) v1(34.41,86.8) v1(34.41,85.43) v1(35.68,85.43) v1(36.95,85.43) v1(38.22,85.43) v1(40,85.43) v1(41.78,85.98) v1(41.78,85.22) v1(42.54,87.21) v1(42.54,85.98) v1(42.54,85.22) v1(43.3,85.98) v1(43.3,85.22) v1(43.81,87.21) v1(45.08,87.21) v1(46.35,87.21) v1(46.35,85.94) v1(47.62,87.21) v1(47.62,85.94) v1(49.4,86.8) v1(50.67,86.8) v1(51.94,86.8)
$1N30672: length 9.5
  Top Layer w0.254: Q3.4 54.22,92.32 54.22,85.3 R12.1
$1N30676: length 1.8
  Top Layer w0.254: R11.2 Q2.4
$1N30680: length 1.8
  Top Layer w0.254: Q4.4 35.71,86.83 R14.2
$1N30684: length 3
  Top Layer w0.254: R15.1 53.21,85.81 Q5.4
$1N30960: length 6.2
  Top Layer w0.254: D4.1 46.22,80.23 45.33,79.34 44.89,79.34 C9.1 43.51,77.96 U1.20
$1N33364: length 8.3
  Top Layer w0.254: R6.1 D3.2 16.62,93.04 15.49,91.91 10.97,91.91 SW1.1
$1N33503: length 8.2
  Top Layer w0.254: SW1.2 7.16,92.47 6.6,91.91 6.6,86.45 6.34,86.19 Q1.4
$1N39218: length 1.6
  Top Layer w0.254: R7.2 46.85,66.38 C7.2
$1N43278: length 2.4
  Top Layer w0.254: U5.8 16.08,64.67 C27.1
$1N43279: length 4.1
  Top Layer w0.254: R17.2 13.1,64.41 R16.1 14.78,64.56 U5.6
$1N43993: length 1.7
  Top Layer w0.254: R18.1 14.24,19.78 14.47,19.56
$1N44340: length 1.5
  Top Layer w0.254: LED2.2 11.18,37.3 R20.1
$1N44411: length 24.9
  Top Layer w0.254: R44.2 v1(1.27,18.95) 1.27,3.6 SW2.1 ; U6.3 6.7,19.52 v1(5.84,19.52)
  Bottom Layer w0.254: v1(1.27,18.95) 1.27,20.28 1.77,20.79 5.2,20.79 5.84,20.16 v1(5.84,19.52)
$1N46790: length 1.5
  Top Layer w0.254: LED4.2 26.16,82.81 R57.2
$3N718: length 1.7
  Top Layer w0.254: LED3.2 26.54,42.85 R21.1
$3N1301: length 3.5
  Top Layer w0.203: U8.1 22.25,48.12 21.97,47.84 21.05,47.84 R27.2
$3N1430: length 5.6
  Top Layer w0.254: U2.16 32.08,20.81 C42.1 34.6,21.61 X1.1
$3N1436: length 7.7
  Top Layer w0.254: U2.15 32.54,20.31 C41.2 33.08,20.16 36.06,20.16 36.66,19.56 X1.3
$3N2154: length 2.5
  Top Layer w0.254: C45.2 26.53,28.59 U2.29
$3N2428: length 3.7
  Top Layer w0.203: R31.2 32.26,26.13 30.94,24.81 U2.24
$3N2431: length 5.4
  Top Layer w0.203: R32.1 29.59,28.41 28.53,27.35 U2.25
$3N2674: length 13.9
  Top Layer w0.203: R30.1 12.32,17.23 15.23,17.23 18.16,20.16 19.17,20.16 19.81,20.79 21.65,20.79 U2.45
$3N2680: length 12.7
  Top Layer w0.203: R29.1 11.74,16.02 12.44,16.73 15.36,16.73 18.41,19.77 19.3,19.77 19.84,20.31 U2.46
$3N2686: length 7.9
  Top Layer w0.203: R28.1 16.5,16.73 19.09,19.31 U2.48
$3N2803: length 6.9
  Top Layer w0.203: U2.1 23.03,16.77 21.32,15.07 R33.2
$3N3189: length 3.1
  Top Layer w0.254: R34.2 21.97,11.28 ADCL1.1
$3N3197: length 3.2
  Top Layer w0.254: R35.2 26.66,11.41 ADCL1.3
$3N3587: length 3.6
  Top Layer w0.254: ADCL2.1 21.86,32.3 R36.2
$3N3590: length 3.6
  Top Layer w0.254: ADCL2.3 17.16,32.22 R37.2
$3N3840: length 3.9
  Top Layer w0.254: R38.2 11.57,28.66 ADCL3.1
$3N3843: length 3.9
  Top Layer w0.254: ADCL3.3 11.7,23.97 R39.2
$3N4387: length 4.5
  Top Layer w0.203: R45.2 28.19,10.8 KEY5.1
$3N4484: length 8.5
  Top Layer w0.203: R46.2 29.71,11.52 31.96,9.27 KEY1.1
$3N4581: length 12.9
  Top Layer w0.203: KEY2.1 40.55,10.5 32.51,10.5 31.36,11.65 31.36,12.8 R47.2
$3N4678: length 17.3
  Top Layer w0.203: KEY3.1 46.07,11.01 33.65,11.01 32.76,11.9 R48.2
$3N4775: length 22.6
  Top Layer w0.203: R49.2 34.28,11.9 34.67,11.52 52.7,11.52 53.97,10.25 KEY4.1
$3N5200: length 6.2
  Top Layer w0.254: BUZZER1.1 68.19,27.65 69.59,29.04 R50.1
$3N5220: length 3.7
  Top Layer w0.254: Q6.3 BUZZER1.2
$3N5339: length 1.6
  Top Layer w0.254: Q6.1 50.21,28.6 R51.1
$3N5727: length 13.5
  Top Layer w0.203: RUNNING1.3 41.67,29.54 R56.1 41.91,29.05 37.59,24.73 R55.2
$3N9278: length 29.2
  Top Layer w0.203: R54.2 56.44,12.92 KEY6.1
$3N9287: length 33.4
  Top Layer w0.203: R53.2 35.81,12.15 36.06,11.9 54.1,11.9 59.43,6.57 59.43,4.53 60.7,3.26 KEY6.2

## Copper pours and planes (outline as drawn; the poured copper is in the pictures)
3V3 on Top Layer: 7.01,36.21 11.7,36.21 11.7,35.03 7.01,35.03
+5V on Top Layer: -0.89,37.94 5.99,37.94 5.99,35.32 -0.89,35.32
+5V on Top Layer: 0.6,22.18 7.33,22.18 7.33,21.07 0.6,21.07
+5V on Top Layer: -0.89,37.94 2.41,37.94 2.41,21.17 -0.89,21.17
+5V on Top Layer: 13.84,47.08 19.58,47.08 19.58,45.71 13.84,45.71
+5V on Top Layer: 11.12,67.65 12.21,66.56 12.21,63.69 5.99,57.47 5.99,35.32 2.77,35.32 2.77,62.3 8.12,67.65
+9V on Top Layer: 54.33,92 54.33,82.92 67.66,82.92 70.1,80.48 70.1,64.22 75.18,64.22 75.18,90.73 73.91,92
+9V on Top Layer: 17.22,71.65 15.23,69.67 15.23,68.79 16.62,68.79 17.9,70.07 21.84,70.07 21.84,71.65
+9V on 辅助电源层: 54.33,92 54.33,82.92 67.66,82.92 70.1,80.48 70.1,64.22 75.18,64.22 75.18,90.73 73.91,92
+9V on 辅助电源层: 17.22,71.44 75.2,71.44 75.2,70.17 17.22,70.17
GND on Top Layer: -5.85,106.77 86.48,106.77 86.48,-7.53 -5.85,-7.53
GND on Bottom Layer: -5.85,106.77 86.48,106.77 86.48,-7.53 -5.85,-7.53
GND on 主GND层: -5.85,106.77 86.48,106.77 86.48,-7.53 -5.85,-7.53
GND on 辅助电源层: -5.85,106.77 86.48,106.77 86.48,-7.53 -5.85,-7.53
VIN on Top Layer: 30.47,74.26 32.23,74.26 32.23,70.01 30.47,70.01
VIN on Top Layer: 6.98,92 30.73,92 30.73,85.69 6.98,85.69
VIN on 辅助电源层: 6.98,85.69 14.47,85.69 15.62,86.83 30.73,86.83 30.73,92 16.85,92 16.25,91.4 6.98,91.4
IMU_3V3 on Top Layer: 20.38,46.7 27.12,46.7 27.12,45.45 20.38,45.45
STC_3V3 on Top Layer: 8.38,21.81 13.35,21.81 13.35,20.74 8.38,20.74
SW1 on Top Layer: 26.92,99.4 41.14,99.4 41.14,88.1 26.92,88.1
SW2 on Top Layer: 43.94,99.4 59.43,99.4 59.43,88.1 43.94,88.1
VCAP on Top Layer: -0.39,93.22 6.13,93.22 6.13,74.89 -0.39,74.89
VCAP on Bottom Layer: -0.39,93.22 6.13,93.22 6.13,74.89 -0.39,74.89
VCAP on 主GND层: -0.39,93.22 6.13,93.22 6.13,74.89 -0.39,74.89
VCAP on 辅助电源层: -0.39,93.22 6.13,93.22 6.13,74.89 -0.39,74.89
$1N30337 on Top Layer: 31.08,87.81 52.47,87.81 52.47,84.65 31.08,84.65
$1N30337 on Bottom Layer: 31.08,87.81 52.47,87.81 52.47,84.65 31.08,84.65
$1N30337 on 主GND层: 31.08,87.81 52.47,87.81 52.47,84.65 31.08,84.65
$1N43946 on Top Layer: 10.67,72.59 10.67,68.63 12.79,66.51 14.35,66.51 14.35,69.56 12.44,71.46 12.44,72.61 10.68,72.61

Small or netless copper shapes (teardrops, artwork), in the pictures only: 341 on Top Layer, 16 on Bottom Layer, 16 on 主GND层, 44 on 辅助电源层

## Text on the board
Document Layer: 车 / 头
Top Layer: 华东理工 / 大学 / 起源-20th / 2025.4.5
Top Silkscreen Layer: OFF | ON | 输入 | 电机 | 软件RST | 电源RST | 3V3 | GND | +5V | RX1 | TX1 | 起跑检测 | 电磁检测 / 5V电源
